# Altium project PCB_Project.PrjPcb
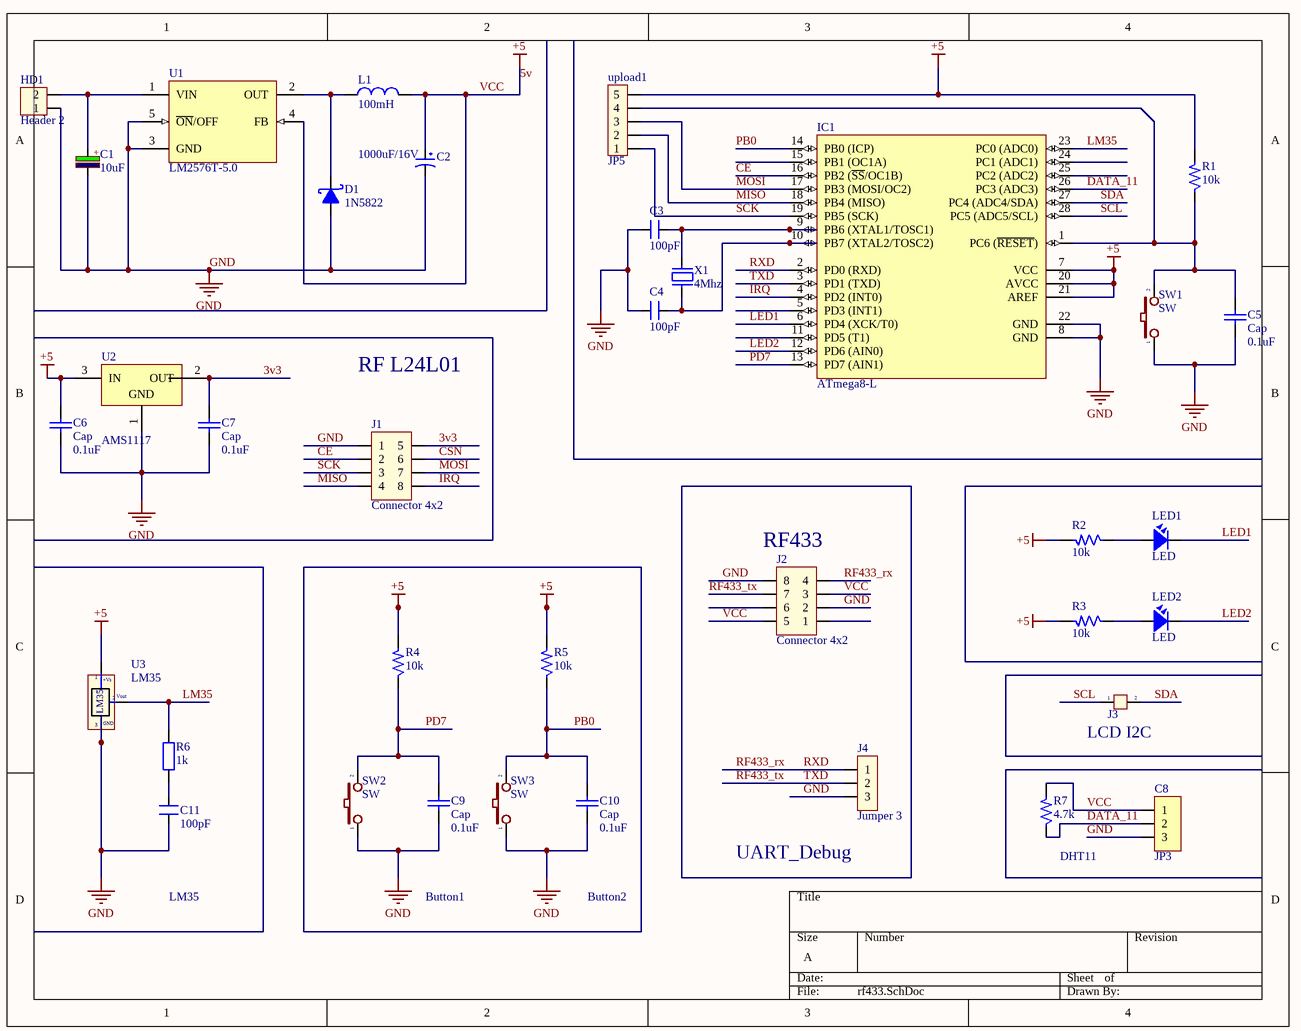
[diagram p0: rf433.SchDoc]
1 sheet, 36 parts. Net scope: global (net labels, ports and power ports of the same name join across sheets).
Board file: PCB1.PcbDoc

## Sheet rf433.SchDoc
size A

### Parts
C1  10uF  [CP1/2]
C2  1000uF/16V  [CP1.5/3.4]
C3  100pF  [CN1]
C4  100pF  [CN1]
C5  Cap  value 0.1uF  [C3MM]
C6  Cap  value 0.1uF  [C3MM]
C7  Cap  value 0.1uF  [C3MM]
C8  JP3  [JP3-C1T]
C9  Cap  value 0.1uF  [C3MM]
C10  Cap  value 0.1uF  [C3MM]
C11  100pF  [CN1]
D1  1N5822  [D5A]
HD1  Header 2  [HED2]
IC1  ATmega8-L  [DIP28/W0.3]
J1  Connector 4x2  [JP4x2]
J2  Connector 4x2  [JP4x2]
J3  Jumper 2  [jp2h]  (value not drawn)
J4  Jumper 3  [JP3]
L1  100mH  [L/0.4]
LED1  LED  [LED-3]
LED2  LED  [LED-3]
R1  10k  [R1/8W]
R2  10k  [R1/8W]
R3  10k  [R1/8W]
R4  10k  [R1/8W]
R5  10k  [R1/8W]
R6  1k  [R1/4W]
R7  4.7k  [R1/8W]
SW1  SW  [SW2]
SW2  SW  [SW2]
SW3  SW  [SW2]
U1  LM2576T-5.0  [LM2576t]
U2  AMS1117  [SOT223]
U3  LM35  [QTO-92]
upload1  JP5  [JP5]
X1  4Mhz  [XT2]

### Nets
5v: C2.1 C6.2 C8.1 IC1.7(VCC) IC1.20(AVCC) IC1.21(AREF) J2.3 J2.5 L1.2 R1.2 R2.2 R3.2 R4.2 R5.2 R7.2 U1.4(FB) U2.3(IN) U3.1(+Vs) upload1.5  [also labelled +5, VCC]
GND: C1.2 C2.2 C3.1 C4.1 C5.1 C6.1 C7.1 C8.3 C9.1 C10.1 C11.1 D1.1(A) HD1.1 IC1.8(GND) IC1.22(GND) J1.1 J2.2 J2.8 J4.3 SW1.1 SW2.1 SW3.1 U1.3(GND) U1.5(~{ON}/OFF) U2.1(GND) U3.3(-)
3v3: C7.2 J1.5 U2.2(OUT) U2.4
CE: IC1.16(PB2_(~{SS}/OC1B)) J1.2
CSN: J1.6
DATA_11: C8.2 IC1.26(PC3_(ADC3)) R7.1
IRQ: IC1.4(PD2_(INT0)) J1.8
LED1: IC1.6(PD4_(XCK/T0)) LED1.2
LED2: IC1.12(PD6_(AIN0)) LED2.2
LM35: IC1.23(PC0_(ADC0)) R6.2 U3.2(Vout)
MISO: IC1.18(PB4_(MISO)) J1.4 upload1.2
MOSI: IC1.17(PB3_(MOSI/OC2)) J1.7 upload1.3
PB0: C10.2 IC1.14(PB0_(ICP)) R5.1 SW3.2
PD7: C9.2 IC1.13(PD7_(AIN1)) R4.1 SW2.2
RF433_rx: IC1.2(PD0_(RXD)) J2.4 J4.1  [also labelled RXD]
RF433_tx: IC1.3(PD1_(TXD)) J2.7 J4.2  [also labelled TXD]
SCK: IC1.19(PB5_(SCK)) J1.3 upload1.1
SCL: IC1.28(PC5_(ADC5/SCL)) J3.1
SDA: IC1.27(PC4_(ADC4/SDA)) J3.2
NetC1_1: C1.1 HD1.2 U1.1(VIN)
NetC3_2: C3.2 IC1.9(PB6_(XTAL1/TOSC1)) X1.2
NetC4_2: C4.2 IC1.10(PB7_(XTAL2/TOSC2)) X1.1
NetC5_2: C5.2 IC1.1(PC6_(~{RESET})) R1.1 SW1.2 upload1.4
NetC11_2: C11.2 R6.1
NetD1_2: D1.2(K) L1.1 U1.2(OUT)
NetLED1_1: LED1.1 R2.1
NetLED2_1: LED2.1 R3.1

Not connected (* = marked no-connect by the designer): IC1 5(PD3_(INT1)) 11(PD5_(T1)) 15(PB1_(OC1A)) 24(PC1_(ADC1)) 25(PC2_(ADC2)); J2 1 6

### Notes on the sheet
- RF L24L01
- (near J2) RF433
- (near J3) LCD I2C
- LM35
- Button1
- Button2
- (near J4) UART_Debug
- (near R7) DHT11
- (in symbol CP0) +
- (in symbol LM35) GND

### Library data of the parts
C1 = CP0: Cap P  0,1uF < 22uF , 16 - 50V; Value: 10uF/50V; Description 1: 10 => 220uF/6,3V/10V - 10uF => 100uF/16V; Description 2: 0,1uF => 33uF/50V - 10uF => 22uF/63V; Description 3: 0,47uF => 10uF/100V
C2 = CP4: Cap 1000uF/16V - 220uF/50V; Description 5: 4,7uF>10uF/250V_3,3uF>10uF/400V - 2,2uF>4,7uF/450V; Description 1: 2200uF-3300uF/6,3V - 1000uF-2200uF/10V; Description 2: 1000uF/16V - 470uF => 1000uF/25V - 100uF/100V; Description 3: 330uF>470uF/35V_220uF>470uF/50V_10uF>22uF/250V; Description 4: 220uF => 330uF/63V - 10uF =>33uF/160 - 200V; Value: 1000uF/16V
C3 C4 C11 = CN1: Cap np  1pF - 472pF; Value: 100pF
C5-C7 C9 C10 = Cap: Capacitor; Published: 8-Jun-2000; LatestRevisionDate: 17-Jul-2002; LatestRevisionNote: Re-released for DXP Platform.; PackageReference: RAD-0.3; Publisher: Altium Limited
C8 = JP3: WR-PHD 2.54 mm Angled Socket Header; Manufacturer: W¨¹rth Elektronik eiSos GmbH; partNo: 613003143121; ComponentLink1 Description: Manufacturer; ComponentLink2 Description: Datasheet; NoPins: 03; Created Date: 29 March 2013; ComponentLink1URL: http://www.we-online.com; ComponentLink2URL: http://katalog.we-online.de/em/datasheet/6130xx143121.pdf; Created by: Karrer Zheng
D1 = 1N5822: Schottky Rectifiers; Value: Diode c?m 1N5408
HD1 = Hed2: Header 2 (Green); Value: Header 2
IC1 = ATmega8-L: 8-Bit AVR Microcontroller with 8K Bytes of In-System Programmable Flash Memory; Value: ATmega8-L
J1 J2 = JP4x2: Value: Connector 4x2
J3 = JP 2: Value: JP 2
J4 = JP3: Value: J3
L1 = L1: Inductor; Value: 150 mH
LED1 LED2 = LED: LED Single colour Green and Red; Value: LED 3 ly Single Colour
R1-R5 R7 = R: Resistor 1/4W; Value: R1/4W - 1K
R6 = R1/4W: Resistor 1/4W; Value: R1/4W - 1K
SW1-SW3 = SW2: Switch button 2 pin; Value: SW chip 2 pin
U1 = LM2576T-5.0: SIMPLE SWITCHER; 3A Step-Down Voltage Regulator; Manufacturer: National Semiconductor; PackageTopMarking: NSUZXYTT*LM2576T*-5.0 P+; PowerWise: N; FirstPublished: 4-Dec-2008; DatasheetVersion: Aug-2004; PackageVersion: revJ, Jan-1992; PackageReference: T05A; Publisher: Altium Limited; PackageDescription: TO-220, Molded, 5 Lead, Straight; CompType: Switcher; PartNumber: LM2576T-5.0; RoHS: O; PinCount: 5; DigiKeyPartNumber: LM2576T-5.0-ND; Code_JEDEC: TO-220-AB; ComponentLink1Description: LM2576 Datasheet; ComponentLink1URL: http://www.national.com/ds/LM/LM2576.pdf; ComponentLink2Description: LM2576 Web Page; ComponentLink2URL: http://www.national.com/pf/LM/LM2576.html; ComponentLink3Description: T05A Package Page; ComponentLink3URL: http://www.national.com/packaging/folders/t05a.html
U2 = AMS117
U3 = LM35: Teminal; Value: LM35
X1 = XT2: Crystal For all Crystal 2pin.; Value: 4Mhz